# EAGLE design HoneyBee (EAGLE 6.5.0)
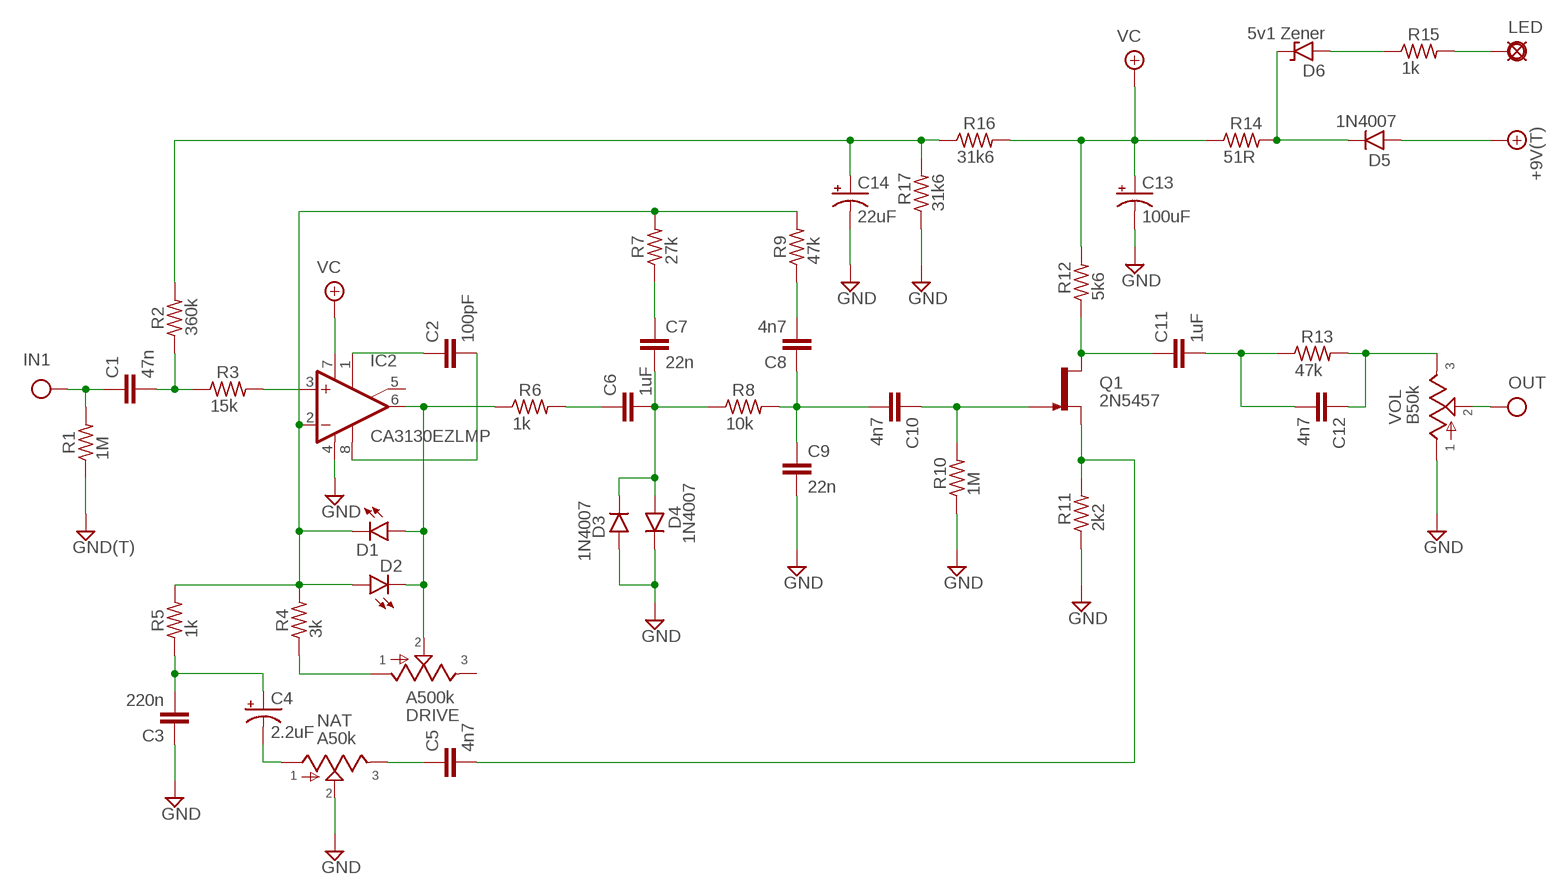
[diagram p0: schematic, sheet 1]

## Parts
+9V  +9V(T)  [SQUARE]
C1  47n  075X0402  [075X040]
C2  100pF  050X030_0251  [050X030_025]
C3  220n  080X0502  [080X050]
C4  2.2uF  0501  [050_020_1]
C5  4n7  070X0302  [070X030]
C6  1uF  080X0502  [080X050]
C7  22n  075X0302  [075X030]
C8  4n7  070X0302  [070X030]
C9  22n  075X0302  [075X030]
C10  4n7  070X0302  [070X030]
C11  1uF  080X0502  [080X050]
C12  4n7  070X0302  [070X030]
C13  100uF  0801  [080_035_1]
C14  22uF  0501  [050_020_1]
D1  LED3MM  [LED3MM]
D2  LED3MM  [LED3MM]
D3  1N4007  1N400X.3  [DO41-3]
D4  1N4007  1N400X.3  [DO41-3]
D5  1N4007  1N400X.3  [DO41-3]
D6  5v1 Zener  1N9ZENER  [DO35-3]
DRIVE  A500k  POT  [POT]
G1  GND(T)  [SQUARE]
IC2  CA3130EZLMP  [DIL08]
IN1  IN(T)  [SQUARE]
LED  3mm  PAD  [SQUARE]
NAT  A50k  POT  [POT]
OUT  OUT(T)  [SQUARE]
Q1  2N5457  [TO92-]
R1  1M  6MM.3  [R0207/3]
R2  360k  6MM.3  [R0207/3]
R3  15k  6MM.3  [R0207/3]
R4  3k  6MM.3  [R0207/3]
R5  1k  6MM.3  [R0207/3]
R6  1k  6MM.3  [R0207/3]
R7  27k  6MM.3  [R0207/3]
R8  10k  6MM.3  [R0207/3]
R9  47k  6MM.3  [R0207/3]
R10  1M  6MM.3  [R0207/3]
R11  2k2  6MM.3  [R0207/3]
R12  5k6  6MM.3  [R0207/3]
R13  47k  6MM.3  [R0207/3]
R14  51R  6MM.3  [R0207/3]
R15  1k  6MM.3  [R0207/3]
R16  31k6  6MM.3  [R0207/3]
R17  31k6  6MM.3  [R0207/3]
VOL  B50k  POT  [POT]

## Nets
+9V: +9V.1(+9V) D5.A
GND: C3.1 C9.2 C13.- C14.- D3.A D4.C G1.1(GND) IC2.4(V-) NAT.2 R1.1 R10.1 R11.1 R17.1 VOL.1
IN: C1.1 IN1.1(IN) R1.2
N$1: C1.2 R2.1 R3.1
N$2: IC2.3(+IN) R3.2
N$3: C3.2 C4.+ R5.1
N$4: D1.K(C) D2.A IC2.2(-IN) R4.2 R5.2 R7.2 R9.2
N$5: C4.- NAT.1
N$6: C5.1 NAT.3
N$7: C6.1 R6.2
N$8: D1.A D2.K(C) DRIVE.2 IC2.6(OUT) R6.1
N$9: DRIVE.1 R4.1
N$10: C2.1 IC2.1(ON1)
N$11: C2.2 IC2.8(OPT)
N$12: C6.2 C7.2 D3.C D4.A R8.1
N$13: C7.1 R7.1
N$14: C8.1 C9.1 C10.2 R8.2
N$15: C8.2 R9.1
N$16: C10.1 Q1.1(G) R10.2
N$17: C5.2 Q1.2(S) R11.2
N$18: C11.1 Q1.3(D) R12.1
N$19: C14.+ R2.2 R16.1 R17.2
N$21: C11.2 C12.2 R13.1
N$22: C12.1 R13.2 VOL.3
N$23: D5.C D6.C R14.2
N$24: D6.A R15.1
N$25: LED.1(PAD) R15.2
OUT: OUT.1(OUT) VOL.2
VC: C13.+ IC2.7(V+) R12.2 R14.1 R16.2
Unconnected: DRIVE.3 IC2.5(ON2)

## Library data of the parts
+9V = mb_supply:+9V(T): +9V Voltage Supply use this to hook up +9v throughout a schematic instead of running wire automatically labels the net "+9v" adds a hookup pad to the circuit board
C1 = mb_caps-chicklet:075X040: 0.039 - 0.047uF Panasonic ECQ-B 7mm x 4mm 50V: 0.039 - 0.047uF;
C2 = mb_caps-ceramic:050X030_025: 47 - 120pF Xicon Ceramic Disc 2.5mm lead spacing
C3 C6 C11 = mb_caps-chicklet:080X050: 0.1uF Panasonic ECQ-B 8mm x 5mm
C4 C14 = mb_caps-electro:050: 0.22 - 100uF Xicon values at Mouser.com: 10V: 10 - 100uF; 16V: 2.2 - 47uF; 25V: 0.47 - 47uF; 50V: 0.22 - 22uF
C5 C8 C10 C12 = mb_caps-chicklet:070X030: 0.0001 - .01uF (100 - 10,000pF) Panasonic ECQ-B 7mm x 3mm 50 or 63V: 0.0001 - .01uF (100 - 10,000pF);
C7 C9 = mb_caps-chicklet:075X030: 0.015 - 0.022uF Panasonic ECQ-B 7.5mm x 3mm 50 or 63V: 0.015 - 0.022uF;
C13 = mb_caps-electro:080: 47 - 470uF Xicon values at Mouser.com 10V: 330, 470uF; 16V: 220, 330uF; 25V: 220uF; 50V: 47, 100uF
D1 D2 = mb_diodes:LED
D3-D5 = mb_diodes:1N400X: Rectifier Diodes often used in power supply to prevent damage from reverse polarization
D6 = mb_diodes:1N9*ZENER: 1N9???B Zener Diode DO-35 case 1N957B - 1N992B (6.8V to 200V)
DRIVE NAT VOL = mb_pots:POT: Potentiometers the arrow indicates the clockwise motion of th wiper (lug 2) fully counter clockwise there is no resistance between lugs 1 and 2 fully clockwise the resistance between lugs 1 and 2 is the value of the pot
G1 = mb_supply:GND(T): Ground use this to hook up ground (GND) throughout a schematic instead of running wire automatically labels the net "GND" adds a hookup pad to the circuit board (you can use several)
IC2 = mb_ics:CA3130EZ: OP AMP
IN1 = mb_supply:IN(T): Input obsolete: use Pad instead and label net shematic input label with circuit board terminal/pad generally used only once on a schematic (because this device labels the net "IN" in the same way as a voltage supply or ground net)
LED = mb_supply:PAD: PAD use this package for pads with any purpose, including input, output, send or return various pad shapes: round, square, octogonal, long, and long offset
OUT = mb_supply:OUT(T): Output obsolete: use Pad instead and label net output label with circuit board terminal/pad usually appears only once on a schematic
Q1 = mb_trans:2N5457: N-CHANNEL JFET
R1-R17 = mb_resistors:6MM: 6mm Resistors Leads spaced 1-6 holes apart for 0.1" perfboard. Suitable for 1/4 watt resistors.

## Board
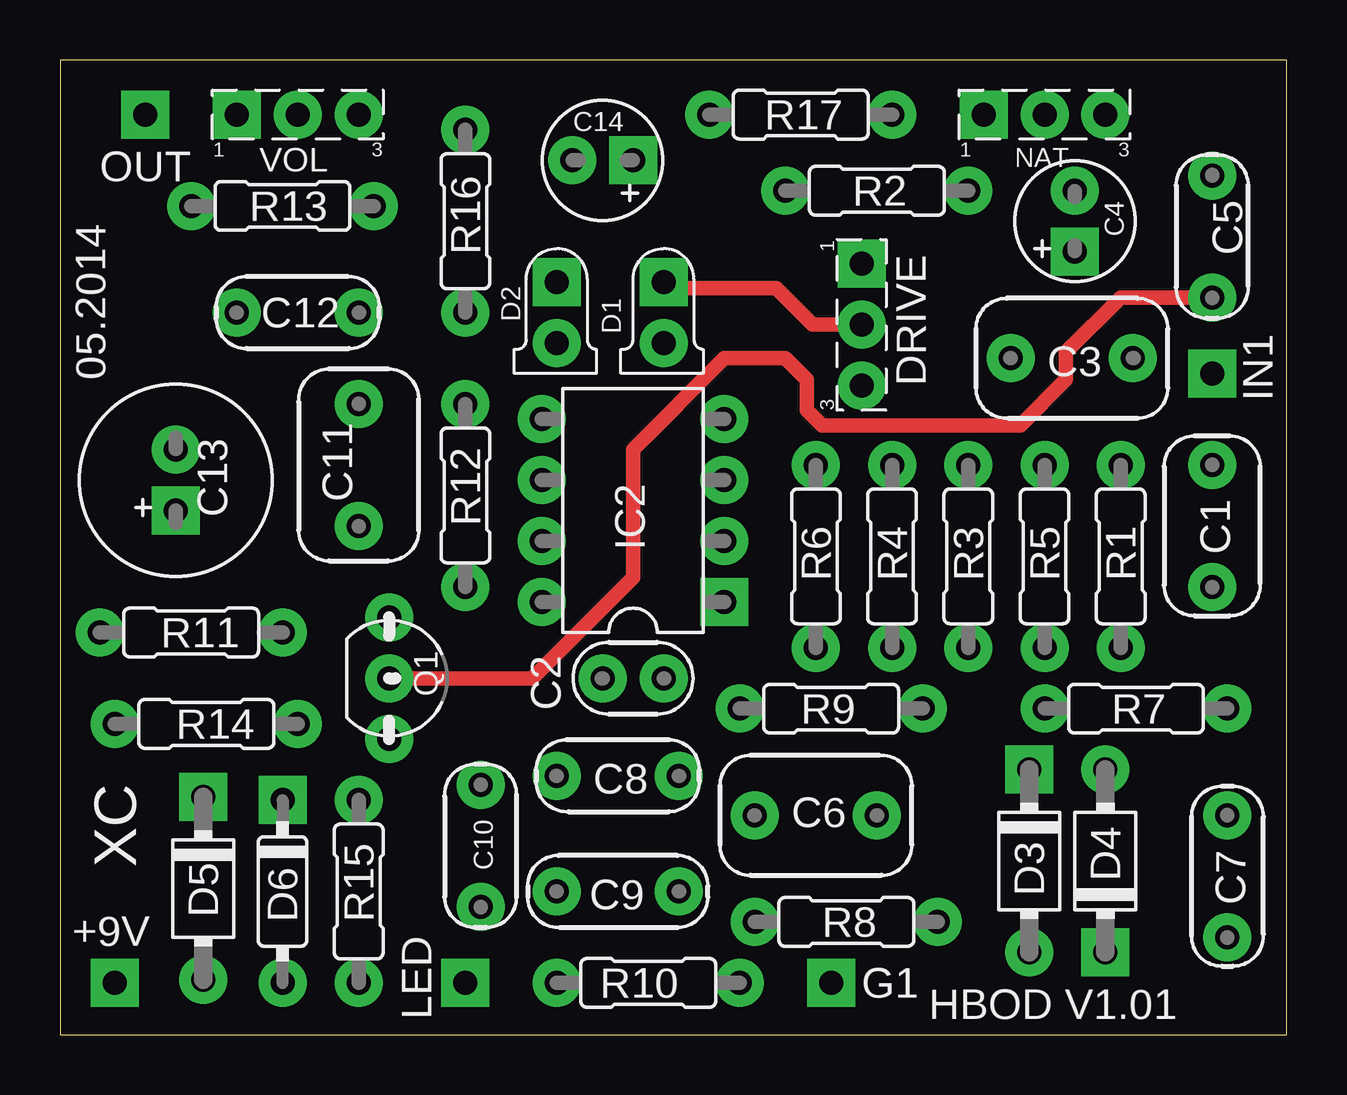
[diagram p1: board, top side]
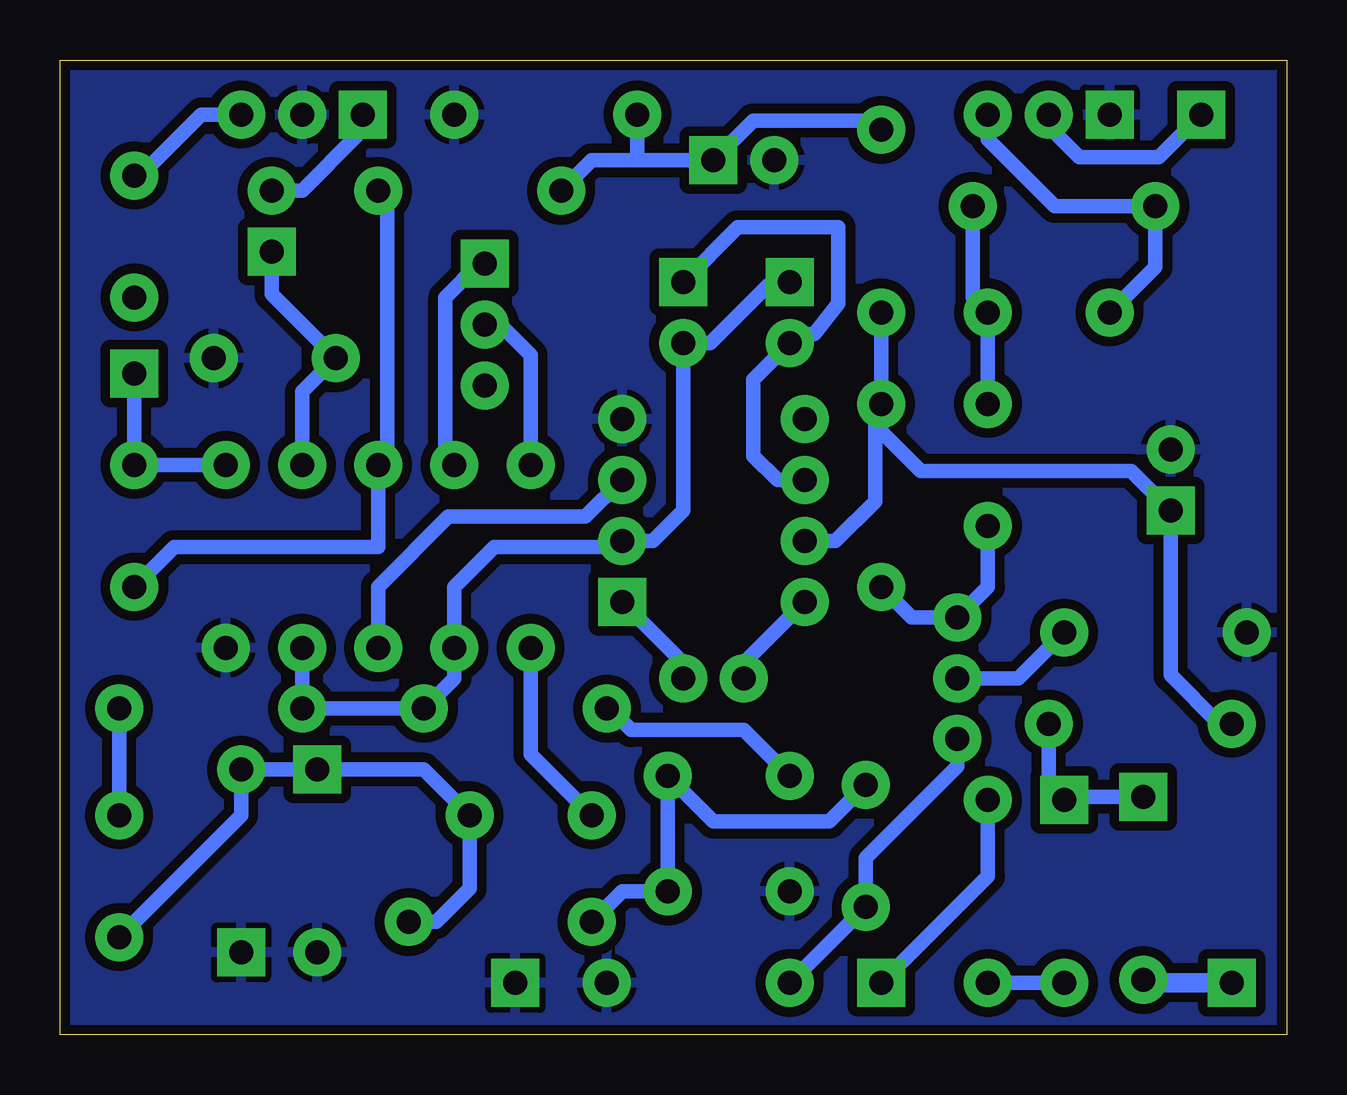
[diagram p2: board, bottom side, seen from below]

Size 51.1 x 40.63 mm. Coordinates in mm from the lower left corner, seen from the top.
Outline: 0,0 51.1,0 51.1,40.63 0,40.63 0,0
Copper layers (1*16): Top 0.0356mm / dielectric 1.5011mm / Bottom 0.0356mm
Design rules "LaenPCBOrder": minimum track width 6mil, minimum drill 13mil, track to track 6mil, track to pad 6mil, pad to pad 6mil, via to via 6mil, smd to smd 6mil, copper to edge 15mil, drill to drill 6mil, minimum pad ring 7mil, minimum via ring 7mil, stop-mask expansion 3mil, vias tented up to drill 0mil, thermal gap 10mil

### Footprints (pad centres in the part's own frame; a part is rotated, then mirrored left to right if it is on the bottom)
SQUARE = drill 1 pad 2 square: 1 0,0
075X040 = drill 1 pad 2: 1 -2.54,0; 2 2.54,0
050X030_025 = drill 1 pad 2: 1 -1.27,0; 2 1.27,0
080X050 = drill 1 pad 2: 1 -2.54,0; 2 2.54,0
050_020_1 = drill 1 pad 2 square: + -1.27,0 | drill 1 pad 2: - 1.27,0
070X030 = drill 1 pad 2: 1 -2.54,0; 2 2.54,0
075X030 = drill 1 pad 2: 1 -2.54,0; 2 2.54,0
080_035_1 = drill 1 pad 2 square: + -1.27,0 | drill 1 pad 2: - 1.27,0
LED3MM = drill 1 pad 2 square: A -1.27,0 | drill 1 pad 2: K 1.27,0
DO41-3 = drill 1 pad 2: A 3.81,0 | drill 1 pad 2 square: C -3.81,0
DO35-3 = drill 1 pad 2: A 3.81,0 | drill 1 pad 2 square: C -3.81,0
POT = drill 1 pad 2 square: 1 2.54,0 | drill 1 pad 2: 2 0,0; 3 -2.54,0
DIL08 = drill 1 pad 2 square: 1 -3.81,-3.81 | drill 1 pad 2: 2 -1.27,-3.81; 3 1.27,-3.81; 4 3.81,-3.81; 5 3.81,3.81; 6 1.27,3.81; 7 -1.27,3.81; 8 -3.81,3.81
TO92- = drill 1 pad 2: 1 2.54,0; 2 0,0; 3 -2.54,0
R0207/3 = drill 1 pad 2: 1 -3.81,0; 2 3.81,0

### Placement (x,y rotation side)
+9V  2.29,2.16 0 top
C1  48.01,21.21 270 top
C2  23.88,14.86 180 top
C3  42.16,28.19 180 top
C4  42.29,33.91 90 top
C5  48.01,33.27 270 top
C6  31.5,9.14 0 top
C7  48.64,6.6 270 top
C8  23.24,10.79 180 top
C9  23.24,5.97 180 top
C10  17.53,7.87 90 top
C11  12.45,23.75 90 top
C12  9.91,30.1 0 top
C13  4.83,23.11 90 top
C14  22.61,36.45 180 top
D1  25.15,30.1 270 top
D2  20.7,30.1 270 top
D3  40.39,7.24 270 top
D4  43.56,7.24 90 top
D5  5.97,6.1 270 top
D6  9.27,5.97 270 top
DRIVE  33.4,29.59 90 top
G1  32.13,2.16 0 top
IC2  23.88,21.84 90 top
IN1  48.01,27.56 0 top
LED  16.89,2.16 0 top
NAT  41.02,38.35 180 top
OUT  3.56,38.35 0 top
Q1  13.72,14.86 270 top
R1  44.2,19.94 90 top
R2  34.04,35.18 180 top
R3  37.85,19.94 270 top
R4  34.67,19.94 270 top
R5  41.02,19.94 270 top
R6  31.5,19.94 270 top
R7  44.83,13.59 180 top
R8  32.77,4.7 180 top
R9  32.13,13.59 0 top
R10  24.51,2.16 180 top
R11  5.46,16.76 0 top
R12  16.89,22.48 90 top
R13  9.27,34.54 180 top
R14  6.1,12.95 0 top
R15  12.45,5.97 90 top
R16  16.89,33.91 270 top
R17  30.86,38.35 180 top
VOL  9.91,38.35 180 top

### Tracks (layer width: path | path; a pad name or v marks a point on that pad's centre or on a via)
+9V
  Bottom 0.813: +9V.1 5.97,2.16 D5.A
GND
  pour Bottom (isolate 0.406): 0,40.01 50.8,40.64 51.44,0 0,0
IN
  Bottom 0.61: R1.2 C1.1 IN1.1
N$1
  Bottom 0.61: C1.2 46.35,20.32 37.85,20.32 R3.1 37.47,24.13 37.47,34.8 R2.1
N$2
  Bottom 0.61: R3.2 37.85,18.67 34.92,21.59 29.21,21.59 IC2.3
N$3
  Bottom 0.61: R5.1 41.02,26.8 C3.2 42.29,30.86 C4.+
N$4
  Bottom 0.61: R5.2 R7.2 R9.2 34.67,14.86 R4.2 34.67,18.67 33.02,20.32 27.94,20.32 IC2.2 26.42,20.57 25.15,21.84 D1.K 24,28.83 21.59,31.24 20.83,31.24 D2.A
N$5
  Bottom 0.61: C4.- 41.02,35.18 38.73,37.47 38.73,38.1 NAT.1
N$6
  Bottom 0.61: C5.1 47.75,35.81 45.21,38.35 NAT.3
N$7
  Bottom 0.61: C6.1 31.5,11.68 R6.2
N$8
  Top 0.61: D1.A 25.4,31.11 29.84,31.11 31.37,29.59 DRIVE.2
  Bottom 0.61: IC2.6 21.21,23.11 22.23,24.13 22.23,27.3 D2.K | 20.57,28.96 D2.K | R6.1 31.5,28.32 32.77,29.59 DRIVE.2 33.27,29.72 | D1.A 22.86,33.66 18.67,33.66 18.67,30.48 19.68,29.21 20.32,29.21 D2.K
N$9
  Bottom 0.61: R4.1 35.05,24.13 35.05,30.73 33.66,32.13 DRIVE.1
N$10
  Bottom 0.61: C2.1 25.15,15.49 IC2.1
N$11
  Bottom 0.61: IC2.8 22.61,15.49 C2.2
N$12
  Bottom 0.61: R8.1 35.43,4.7 34.04,6.1 C6.2 35.94,11.05 D3.C D4.A 43.56,9.14 C7.2
N$13
  Bottom 0.61: C7.1 R7.1
N$14
  Bottom 0.61: R8.2 27.69,5.97 C9.1 C8.1 23.88,8.89 19.05,8.89 C10.2
N$15
  Bottom 0.61: C8.2 22.61,12.7 27.3,12.7 28.19,13.59 R9.1
N$16
  Bottom 0.61: R10.2 C10.1 17.53,7.37 13.72,11.18 Q1.1
N$17
  Top 0.61: Q1.2 19.68,14.86 23.88,19.05 23.88,24.38 27.69,28.19 30.23,28.19 31.11,27.3 31.11,26.04 31.75,25.4 40.01,25.4 41.91,27.3 41.91,28.45 44.2,30.73 C5.2
  Bottom 0.61: Q1.2 11.18,14.86 R11.2
N$18
  Bottom 0.61: R12.1 15.62,17.4 Q1.3 12.45,18.67 C11.1
N$19
  Bottom 0.61: 16.89,37.97 R16.1 17.27,38.1 22.23,38.1 C14.+ 27.18,36.45 | R2.2 28.96,36.45 27.18,36.45 | R17.2 27.05,36.58 27.18,36.45
N$21
  Bottom 0.61: C11.2 C12.2 13.08,30.73 R13.1
N$22
  Bottom 0.61: C12.1 5.46,32 R13.2 9.65,34.54 12.45,37.34 VOL.3
N$23
  Bottom 0.61: R14.2 9.91,10.41 D6.C 9.27,9.91 D5.C
N$24
  Bottom 0.61: D6.A R15.1
N$25
  Bottom 0.61: LED.1 12.45,6.6 R15.2
OUT
  Bottom 0.61: VOL.2 9.91,37.85 8.64,36.58 5.33,36.58 OUT.1
VC
  Bottom 0.61: R12.2 R16.2 | R12.2 16.89,25.15 15.24,23.5 6.48,23.5 C13.+ 4.83,14.99 2.79,12.95 R14.1 | IC2.7 18.8,20.57 17.14,22.23 17.14,26.04 R12.2

### Text on the board
tNames: 05.2014 | XC | HBOD V1.01